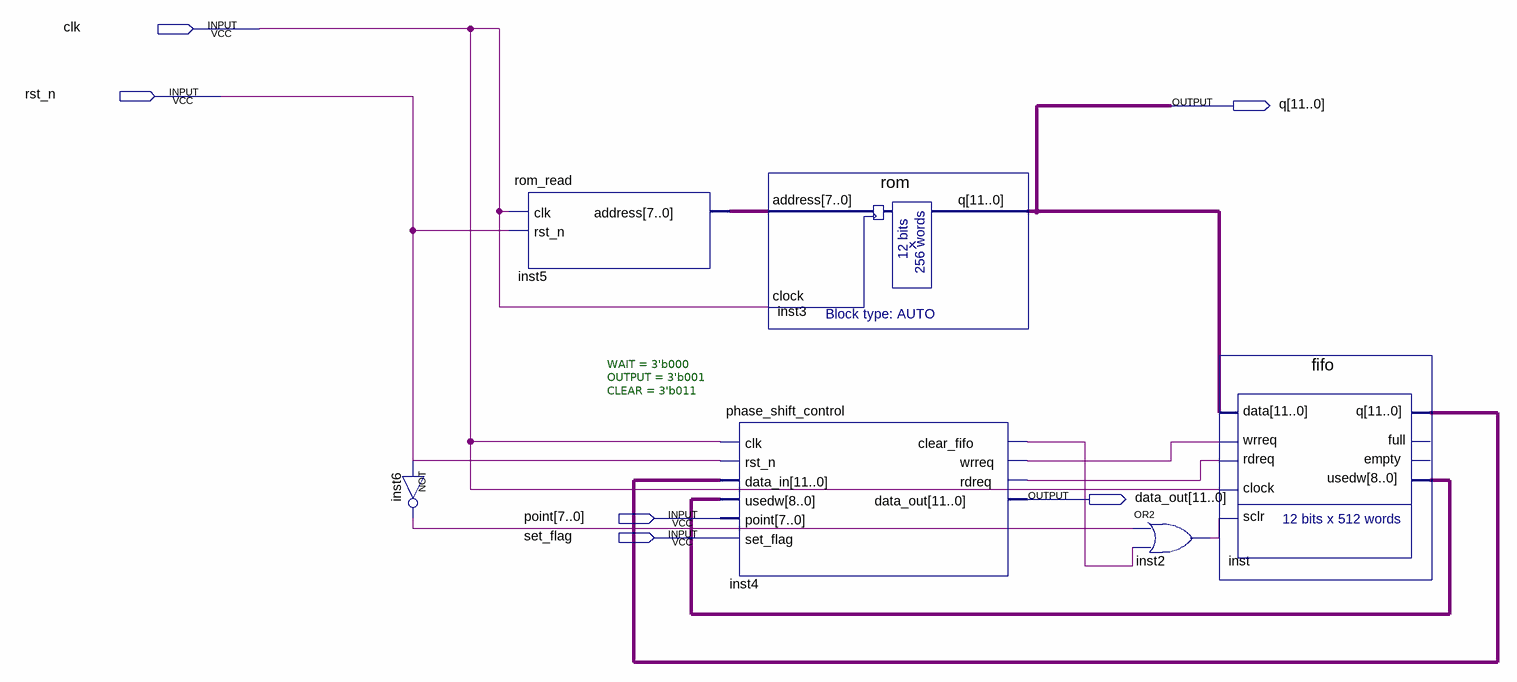
[diagram p0: schematic sheet]
// Quartus schematic phase_shift.bdf as structural Verilog: 6 symbols, 6 pins
module phase_shift (
  input  clk,
  input  rst_n,
  input  [7:0] point,
  input  set_flag,
  output [11:0] q,
  output [11:0] data_out
);

  wire inst2_out, inst4_clear_fifo, inst4_rdreq, inst4_wrreq, inst6_out;
  wire [7:0] inst5_address;
  wire [8:0] inst_usedw;
  wire [11:0] inst_q;

  not inst6 (inst6_out, rst_n);
  rom_read inst5 (.clk(clk), .rst_n(rst_n), .address(inst5_address));
  phase_shift_control #(.WAIT(3'b000), .OUTPUT(3'b001), .CLEAR(3'b011)) inst4 (
    .clk(clk), .rst_n(rst_n), .data_in(inst_q), .usedw(inst_usedw), .point(point), .set_flag(set_flag),
    .clear_fifo(inst4_clear_fifo), .wrreq(inst4_wrreq), .rdreq(inst4_rdreq), .data_out(data_out));
  rom inst3 (.address(inst5_address), .clock(clk), .q(q));
  or inst2 (inst2_out, inst6_out, inst4_clear_fifo);
  fifo inst (
    .data(q), .wrreq(inst4_wrreq), .rdreq(inst4_rdreq), .clock(clk), .sclr(inst2_out), .q(inst_q),
    .usedw(inst_usedw));  // open: full, empty
endmodule
